# EasyEDA schematic SCH_MX80_I_MOTHERBOARD.json
TITLE: Sheet_1; REV: 1.0; Date: 2024-11-14; Sheet: 1/1; Company: MaxRetroElec
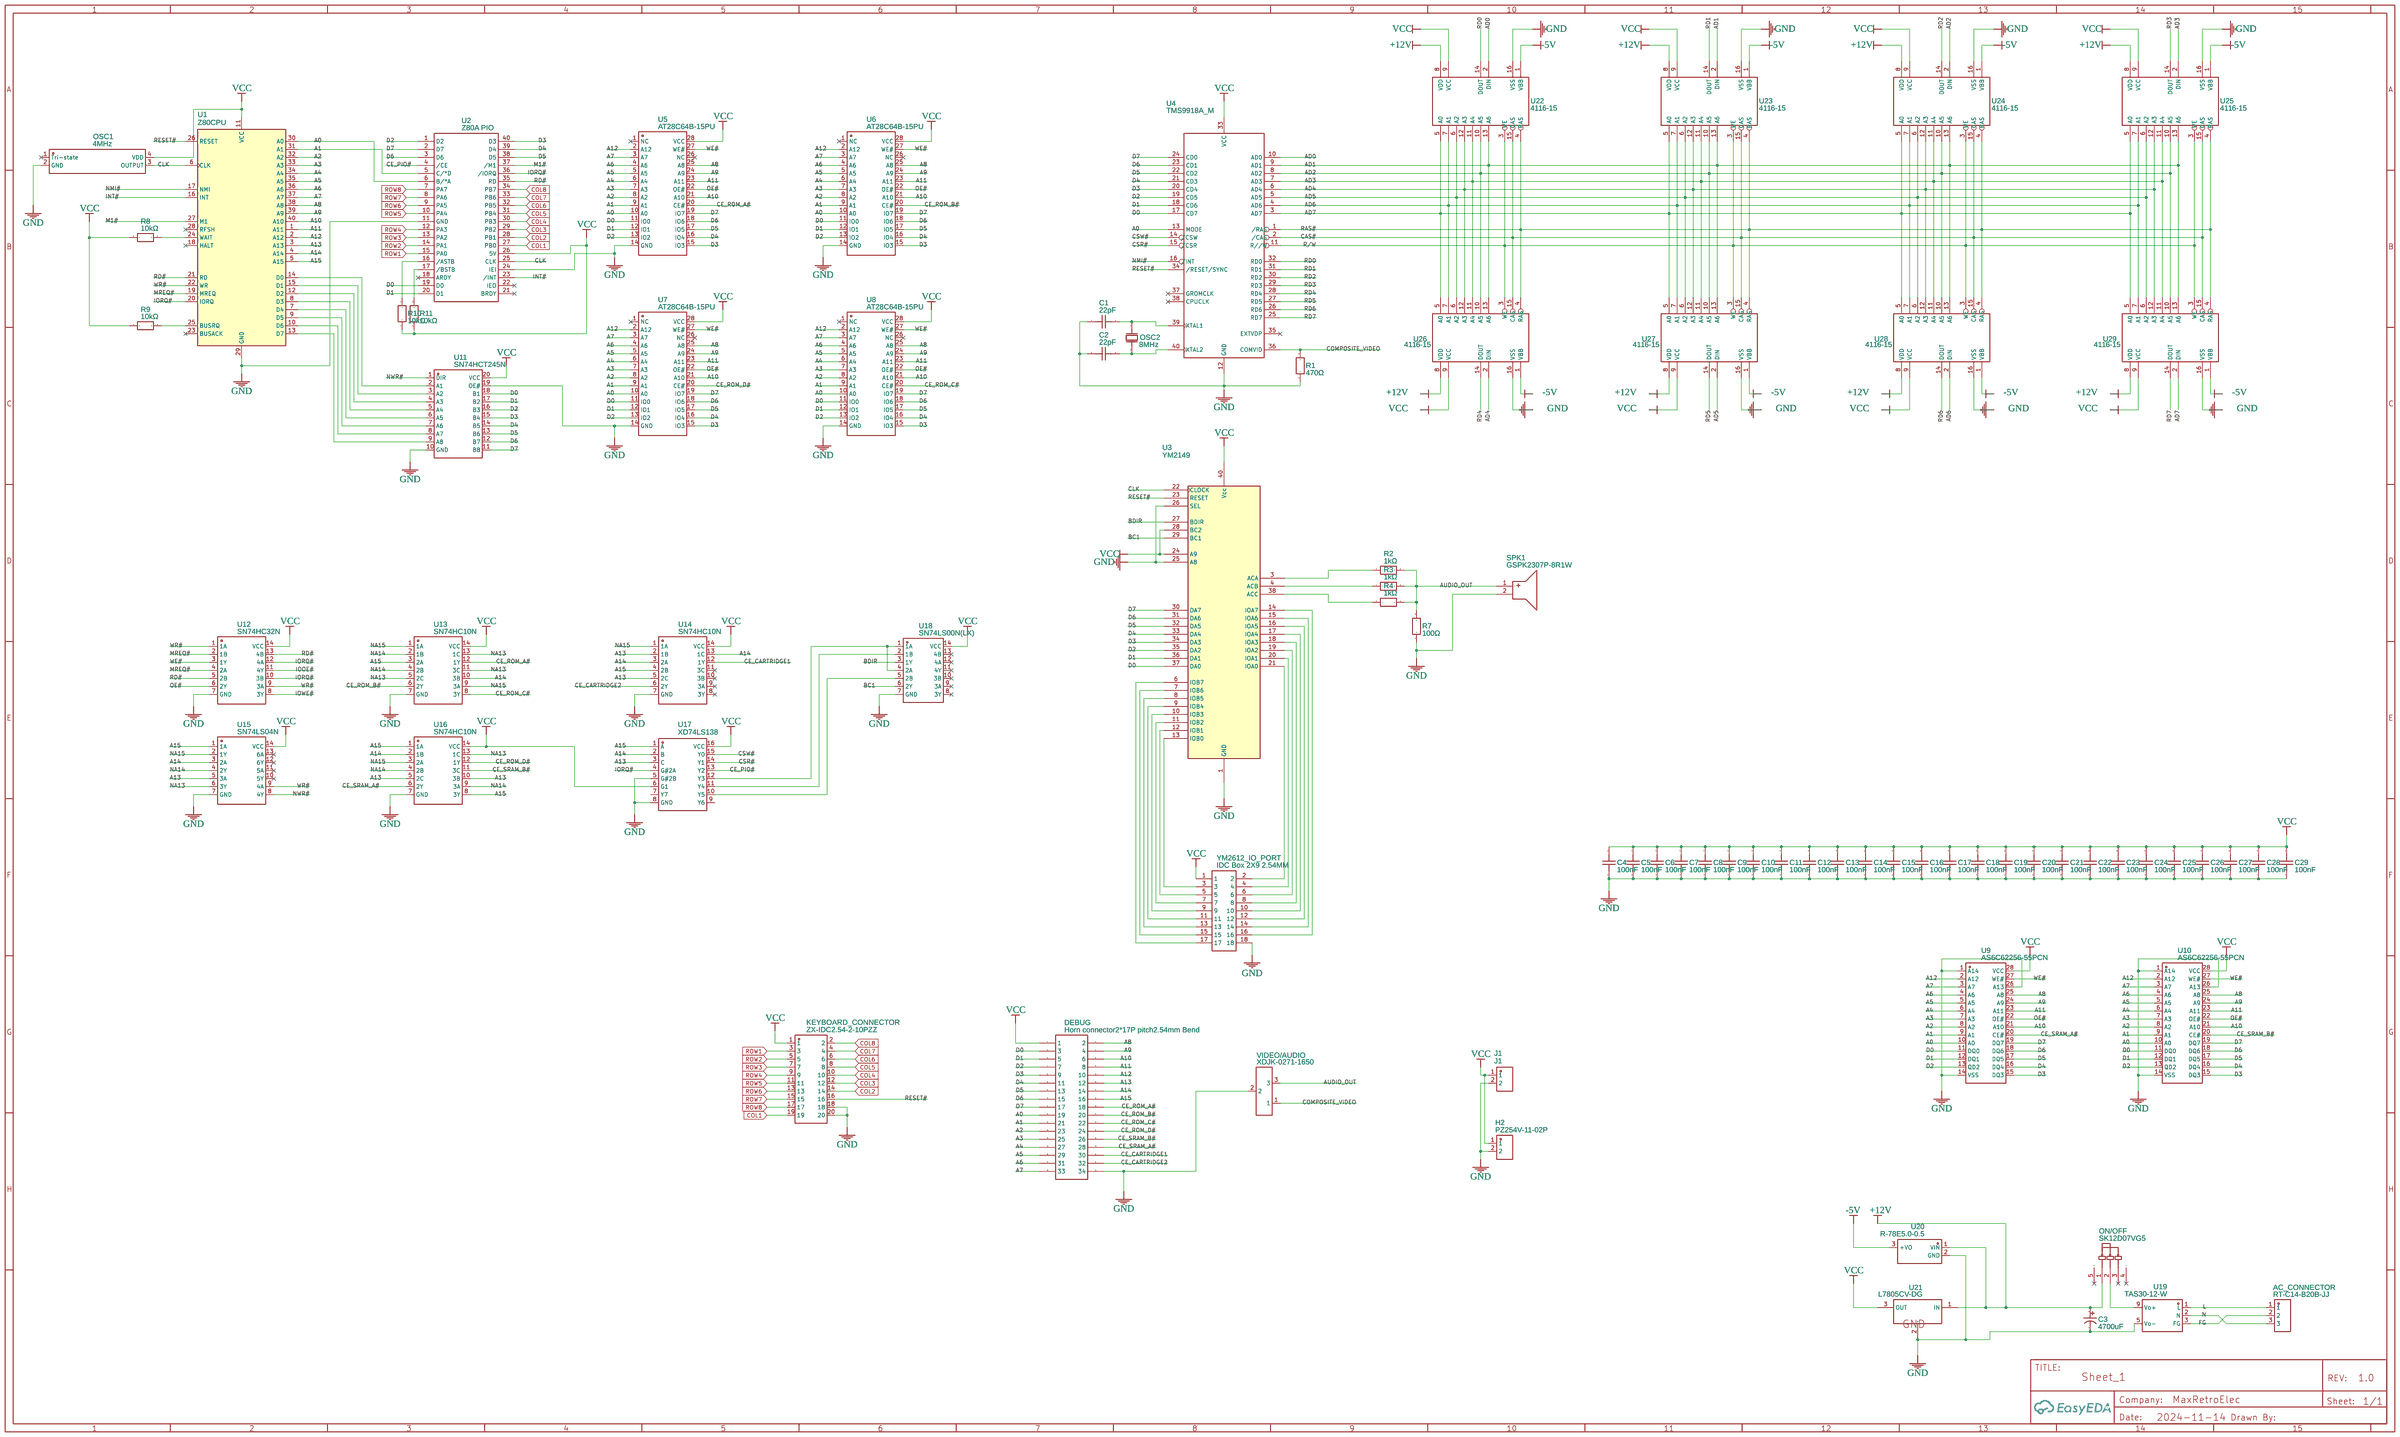
[diagram p0: schematic sheet]

## Parts
AC_CONNECTOR  RT-C14-B20B-JJ  [AC-IN-TH_LEGION_RT-C14-B20B-JJ]
C1  22pF  [CAP-TH_L7.5-W5.0-P7.50-D0.7]
C2  22pF  [CAP-TH_L7.5-W5.0-P7.50-D0.7]
C3  4700uF  [CAP-TH_BD16.0-P7.50-D1.2-FD]
C4  100nF  [CAP-TH_L5.0-W2.5-P5.08-D0.7]
C5  100nF  [CAP-TH_L5.0-W2.5-P5.08-D0.7]
C6  100nF  [CAP-TH_L5.0-W2.5-P5.08-D0.7]
C7  100nF  [CAP-TH_L5.0-W2.5-P5.08-D0.7]
C8  100nF  [CAP-TH_L5.0-W2.5-P5.08-D0.7]
C9  100nF  [CAP-TH_L5.0-W2.5-P5.08-D0.7]
C10  100nF  [CAP-TH_L5.0-W2.5-P5.08-D0.7]
C11  100nF  [CAP-TH_L5.0-W2.5-P5.08-D0.7]
C12  100nF  [CAP-TH_L5.0-W2.5-P5.08-D0.7]
C13  100nF  [CAP-TH_L5.0-W2.5-P5.08-D0.7]
C14  100nF  [CAP-TH_L5.0-W2.5-P5.08-D0.7]
C15  100nF  [CAP-TH_L5.0-W2.5-P5.08-D0.7]
C16  100nF  [CAP-TH_L5.0-W2.5-P5.08-D0.7]
C17  100nF  [CAP-TH_L5.0-W2.5-P5.08-D0.7]
C18  100nF  [CAP-TH_L5.0-W2.5-P5.08-D0.7]
C19  100nF  [CAP-TH_L5.0-W2.5-P5.08-D0.7]
C20  100nF  [CAP-TH_L5.0-W2.5-P5.08-D0.7]
C21  100nF  [CAP-TH_L5.0-W2.5-P5.08-D0.7]
C22  100nF  [CAP-TH_L5.0-W2.5-P5.08-D0.7]
C23  100nF  [CAP-TH_L5.0-W2.5-P5.08-D0.7]
C24  100nF  [CAP-TH_L5.0-W2.5-P5.08-D0.7]
C25  100nF  [CAP-TH_L5.0-W2.5-P5.08-D0.7]
C26  100nF  [CAP-TH_L5.0-W2.5-P5.08-D0.7]
C27  100nF  [CAP-TH_L5.0-W2.5-P5.08-D0.7]
C28  100nF  [CAP-TH_L5.0-W2.5-P5.08-D0.7]
C29  100nF  [CAP-TH_L5.0-W2.5-P5.08-D0.7]
DEBUG  Horn connector2*17P pitch2.54mm Bend  [IDC-TH_HORNCONNECTOR2-17PPITCH2.54MMBEND]
H2  PZ254V-11-02P  [HDR-TH_2P-P2.54-V-M]
J1  J1  [HDR-TH_2P-P2.54-V-F]
KEYBOARD_CONNECTOR  ZX-IDC2.54-2-10PZZ  [IDC-TH_20P-P2.54_ZX-IDC2.54-2-10PZZ]
ON/OFF  SK12D07VG5  [SW-TH_SK12D07VG5]
OSC1  4MHz  [OSC-SMD_4P-L7.0-W5.0-BL]
OSC2  8MHz  [OSC-TH_L10.0-W4.5-P5.00]
R1  470Ω  [RES-TH_BD2.3-L6.5-P10.50-D0.5]
R2  1kΩ  [RES-TH_BD2.7-L6.2-P10.20-D0.4]
R3  1kΩ  [RES-TH_BD2.7-L6.2-P10.20-D0.4]
R4  1kΩ  [RES-TH_BD2.7-L6.2-P10.20-D0.4]
R7  100Ω  [RES-TH_BD2.7-L6.2-P10.20-D0.4]
R8  10kΩ  [RES-TH_BD2.7-L6.2-P10.20-D0.4]
R9  10kΩ  [RES-TH_BD2.7-L6.2-P10.20-D0.4]
R10  10kΩ  [RES-TH_BD2.7-L6.2-P10.20-D0.4]
R11  10kΩ  [RES-TH_BD2.7-L6.2-P10.20-D0.4]
SPK1  GSPK2307P-8R1W  [SPK-TH_BD23.0-P10.00-D0.8-L-RD]
U1  Z80CPU  [Z80DIP]
U2  Z80A PIO  [Z80A PIO]
U3  YM2149  [DIP-40_W15.24MM_LONGPADS]
U4  TMS9918A_M  [PDIP-40_L52.3-W13.8-P2.54-LS15.24-BL]
U5  AT28C64B-15PU  [DIP-28_L37.0-W13.8-P2.54-LS15.8-BL]
U6  AT28C64B-15PU  [DIP-28_L37.0-W13.8-P2.54-LS15.8-BL]
U7  AT28C64B-15PU  [DIP-28_L37.0-W13.8-P2.54-LS15.8-BL]
U8  AT28C64B-15PU  [DIP-28_L37.0-W13.8-P2.54-LS15.8-BL]
U9  AS6C62256-55PCN  [PDIP-28_L37.0-W13.5-P2.54-LS15.6-BL]
U10  AS6C62256-55PCN  [PDIP-28_L37.0-W13.5-P2.54-LS15.6-BL]
U11  SN74HCT245N  [DIP-20_L26.8-W6.4-P2.54-LS7.6-BL]
U12  SN74HC32N  [DIP-14_L19.0-W7.0-P2.54-LS7.6-BL]
U13  SN74HC10N  [DIP-14_L19.0-W7.0-P2.54-LS7.6-BL]
U14  SN74HC10N  [DIP-14_L19.0-W7.0-P2.54-LS7.6-BL]
U15  SN74LS04N  [PDIP-14_L19.7-W6.6-P2.54-LS8.3-BL]
U16  SN74HC10N  [DIP-14_L19.0-W7.0-P2.54-LS7.6-BL]
U17  XD74LS138  [DIP-16_L19.8-W6.5-P2.54-LS7.6-BL]
U18  SN74LS00N(LX)  [PDIP-14_L19.3-W6.4-P2.54-LS7.9-BL]
U19  TAS30-12-W  [PWRM-TH_TAS30-XX-W]
U20  R-78E5.0-0.5  [PWRM-TH_YLPTEC_R-78EXXX]
U21  L7805CV-DG  [TO-220-3_L10.0-W4.5-P2.54-L]
U22  4116-15  [DIP16]
U23  4116-15  [DIP16]
U24  4116-15  [DIP16]
U25  4116-15  [DIP16]
U26  4116-15  [DIP16]
U27  4116-15  [DIP16]
U28  4116-15  [DIP16]
U29  4116-15  [DIP16]
VIDEO/AUDIO  XDJK-0271-1650  [CONN-TH_XDJK-0271-1650]
YM2612_IO_PORT  IDC Box 2X9 2.54MM  [IDC-TH_18P-P2.54_300R-18P]

## Library data of the parts
AC_CONNECTOR = RT-C14-B20B-JJ: Supplier: LCSC; Supplier Part: C19190834; Manufacturer: Legion(六钧); Contributor: lcsc; JLCPCB Part Class: Extended Part
C1 C2 = CC45SL3JD220JYNNA: Contributor: LCSC; Supplier: LCSC; Supplier Part: C342437; Manufacturer: TDK; JLCPCB Part Class: Extended Part
C3 = 4700uF25V: Supplier: LCSC; Manufacturer: CX(承兴); Manufacturer Part: KM478M025K30RR0VH2FP0; Supplier Part: C30585; JLCPCB Part Class: Extended Part
C4-C29 = CC1H104ZC74D3F5O30MN: Contributor: LCSC; Supplier: LCSC; Supplier Part: C254094; Manufacturer: Dersonic(德尔创); JLCPCB Part Class: Extended Part
DEBUG = Horn connector2*17P pitch2.54mm Bend: Contributor: LCSC; Supplier: LCSC; Manufacturer: BOOMELE(博穆精密); Manufacturer Part: 2.54-2*17P弯简牛; Supplier Part: C79866; JLCPCB Part Class: Extended Part
H2 = PZ254V-11-02P: Contributor: LCSC; Supplier: LCSC; Supplier Part: C492401; Manufacturer: XFCN(兴飞); JLCPCB Part Class: Extended Part
J1 = ZX-PM2.54-1-2PY: Supplier: LCSC; Supplier Part: C7499322; Manufacturer: Megastar(兆星); Contributor: lcsc; JLCPCB Part Class: Extended Part
KEYBOARD_CONNECTOR = ZX-IDC2.54-2-10PZZ: Supplier: LCSC; Supplier Part: C7501245; Manufacturer: Megastar(兆星); Contributor: lcsc; JLCPCB Part Class: Extended Part
ON/OFF = SK12D07VG5: Contributor: LCSC; Supplier: LCSC; Supplier Part: C431548; Manufacturer: SHOU HAN(首韩); JLCPCB Part Class: Extended Part
OSC1 = S7D4.000000B20F30T: Contributor: LCSC; Supplier: LCSC; Supplier Part: C386918; Manufacturer: SCTF(星通时频); JLCPCB Part Class: Extended Part
OSC2 = X49SD8MSD2SC: Supplier: LCSC; Manufacturer: YXC(扬兴晶振); Supplier Part: C21263; JLCPCB Part Class: Extended Part
R1 = CF1/4W-470Ω±5%T52: Contributor: lcsc; Supplier: LCSC; Supplier Part: C714293; Manufacturer: 华星机电; JLCPCB Part Class: Extended Part
R2-R4 = CR1/4W-1K±5%-ST52: Contributor: lcsc; Supplier: LCSC; Supplier Part: C2894660; Manufacturer: VO(翔胜); JLCPCB Part Class: Extended Part
R7 = CR1/4W-100Ω±5%-ST52: Contributor: lcsc; Supplier: LCSC; Supplier Part: C2894648; Manufacturer: VO(翔胜); JLCPCB Part Class: Extended Part; link: https://lcsc.com/eda_search?q=C2894648&%26type=1&ref=editor
R8-R11 = CR1/4W-10K±5%-ST52: Contributor: lcsc; Supplier: LCSC; Supplier Part: C2894649; Manufacturer: VO(翔胜); JLCPCB Part Class: Extended Part; link: https://lcsc.com/eda_search?q=C2894649&%26type=1&ref=editor
SPK1 = GSPK2307P-8R1W: Contributor: LCSC; Supplier: LCSC; Supplier Part: C530531; Manufacturer: INGHAi(赢海); JLCPCB Part Class: Extended Part
U1 = Z80CPU: Contributor: capsule5000
U2 = Z80A PIO: Supplier: Zilog; Contributor: latsirk399
U3 = YM2149: Contributor: David Sporn
U4 = TMS9918A_M: Contributor: Peti
U5-U8 = AT28C64B-15PU: Supplier: LCSC; Manufacturer: MICROCHIP(美国微芯); Supplier Part: C41982; JLCPCB Part Class: Extended Part
U9 U10 = AS6C62256-55PCN: Supplier: LCSC; Supplier Part: C5569983; Manufacturer: Alliance Memory; JLCPCB Part Class: Extended Part; Contributor: lcsc
U11 = SN74HCT245N: Contributor: LCSC; Supplier: LCSC; Supplier Part: C133640; Manufacturer: TI(德州仪器); JLCPCB Part Class: Extended Part
U12 = SN74HC32N: Supplier: LCSC; Manufacturer: TI(德州仪器); Supplier Part: C2894; JLCPCB Part Class: Extended Part
U13 U14 U16 = SN74HC10N: Supplier: LCSC; Manufacturer: TI(德州仪器); Supplier Part: C2888; JLCPCB Part Class: Extended Part
U15 = SN74LS04N: Contributor: LCSC; Supplier: LCSC; Supplier Part: C183657; Manufacturer: TI(德州仪器); JLCPCB Part Class: Extended Part
U17 = XD74LS138: Contributor: LCSC; Supplier: LCSC; Supplier Part: C513527; Manufacturer: XINLUDA(信路达); JLCPCB Part Class: Extended Part
U18 = SN74LS00N(LX): Supplier: LCSC; Supplier Part: C22374089; Manufacturer: LX(灵星芯微); JLCPCB Part Class: Extended Part; Contributor: lcsc
U19 = TAS30-12-W: Contributor: LCSC; Supplier: LCSC; Supplier Part: C570985; Manufacturer: TDPOWER(腾达电源); JLCPCB Part Class: Extended Part
U20 = R-78E5.0-0.5: Supplier: LCSC; Supplier Part: C18212367; Manufacturer: YLPTEC(易川); Contributor: lcsc; JLCPCB Part Class: Extended Part; link: https://lcsc.com/eda_search?q=C18212367&%26type=1&ref=editor
U21 = L7805CV-DG: Supplier: LCSC; Manufacturer: ST(意法半导体); Supplier Part: C3795; JLCPCB Part Class: Extended Part
U22-U29 = 4116-15: Manufacturer: Major Brands; Supplier: Jameco; Supplier Part: 41339; link: https://www.jameco.com/Jameco/Products/ProdDS/41339%20Fujitsu.pdf; Contributor: valdezramses03
VIDEO/AUDIO = XDJK-0271-1650: Supplier: LCSC; Supplier Part: C7527522; Manufacturer: LX(连欣科技); Contributor: lcsc; JLCPCB Part Class: Extended Part
YM2612_IO_PORT = IDC Box 2X9 2.54MM: Contributor: LCSC; Supplier: LCSC; Manufacturer: BOOMELE(博穆精密); Manufacturer Part: 2.54-2*9P 弯 简牛; Supplier Part: C9143; JLCPCB Part Class: Extended Part

## Nets
+12V: C3.1 ON/OFF.1 U20.1(VIN) U21.1(IN) U22.8(VDD) U23.8(VDD) U24.8(VDD) U25.8(VDD) U26.8(VDD) U27.8(VDD) U28.8(VDD) U29.8(VDD)
-5V: U20.3(+VO) U22.1(VBB) U23.1(VBB) U24.1(VBB) U25.1(VBB) U26.1(VBB) U27.1(VBB) U28.1(VBB) U29.1(VBB)
GND: C1.1 C2.1 C3.2 C4.1 C5.1 C6.1 C7.1 C8.1 C9.1 C10.1 C11.1 C12.1 C13.1 C14.1 C15.1 C16.1 C17.1 C18.1 C19.1 C20.1 C21.1 C22.1 C23.1 C24.1 C25.1 C26.1 C27.1 C28.1 C29.1 DEBUG.34 H2.2 J1.2 KEYBOARD_CONNECTOR.18 KEYBOARD_CONNECTOR.20 OSC1.2(GND) R1.1 R7.1 SPK1.2(-) U1.29(GND) U2.11(GND) U2.24(IEI) U3.1(GND) U3.25(A8) U3.26(SEL) U4.12(GND) U5.14(GND) U6.14(GND) U7.14(GND) U8.14(GND) U9.1(A14) U9.14(VSS) U9.26(A13) U10.1(A14) U10.14(VSS) U10.26(A13) U11.10(GND) U11.19(OE#) U12.7(GND) U13.7(GND) U14.7(GND) U15.7(GND) U16.7(GND) U17.5(G#2B) U17.8(GND) U18.7(GND) U19.5(Vo-) U20.2(GND) U21.2(GND) U22.16(VSS) U23.16(VSS) U24.16(VSS) U25.16(VSS) U26.16(VSS) U27.16(VSS) U28.16(VSS) U29.16(VSS) VIDEO/AUDIO.2 YM2612_IO_PORT.18
VCC: C4.2 C5.2 C6.2 C7.2 C8.2 C9.2 C10.2 C11.2 C12.2 C13.2 C14.2 C15.2 C16.2 C17.2 C18.2 C19.2 C20.2 C21.2 C22.2 C23.2 C24.2 C25.2 C26.2 C27.2 C28.2 C29.2 DEBUG.1 H2.1 J1.1 KEYBOARD_CONNECTOR.1 OSC1.4(VDD) R8.1 R9.1 R10.1 R11.1 U1.11(VCC) U2.26(5V) U3.24(A9) U3.28(BC2) U3.40(Vcc) U4.33(VCC) U5.28(VCC) U6.28(VCC) U7.28(VCC) U8.28(VCC) U9.28(VCC) U10.28(VCC) U11.20(VCC) U12.14(VCC) U13.14(VCC) U14.14(VCC) U15.14(VCC) U16.14(VCC) U17.6(G1) U17.16(VCC) U18.14(VCC) U21.3(OUT) U22.9(VCC) U23.9(VCC) U24.9(VCC) U25.9(VCC) U26.9(VCC) U27.9(VCC) U28.9(VCC) U29.9(VCC) YM2612_IO_PORT.1
A0: DEBUG.19 U1.30(A0) U2.6(B/*A) U4.13(MODE) U5.10(A0) U6.10(A0) U7.10(A0) U8.10(A0) U9.10(A0) U10.10(A0)
A1: DEBUG.21 U1.31(A1) U2.5(C/*D) U5.9(A1) U6.9(A1) U7.9(A1) U8.9(A1) U9.9(A1) U10.9(A1)
A2: DEBUG.23 U1.32(A2) U5.8(A2) U6.8(A2) U7.8(A2) U8.8(A2) U9.8(A2) U10.8(A2)
A3: DEBUG.25 U1.33(A3) U5.7(A3) U6.7(A3) U7.7(A3) U8.7(A3) U9.7(A3) U10.7(A3)
A4: DEBUG.27 U1.34(A4) U5.6(A4) U6.6(A4) U7.6(A4) U8.6(A4) U9.6(A4) U10.6(A4)
A5: DEBUG.29 U1.35(A5) U5.5(A5) U6.5(A5) U7.5(A5) U8.5(A5) U9.5(A5) U10.5(A5)
A6: DEBUG.31 U1.36(A6) U5.4(A6) U6.4(A6) U7.4(A6) U8.4(A6) U9.4(A6) U10.4(A6)
A7: DEBUG.33 U1.37(A7) U5.3(A7) U6.3(A7) U7.3(A7) U8.3(A7) U9.3(A7) U10.3(A7)
A8: DEBUG.2 U1.38(A8) U5.25(A8) U6.25(A8) U7.25(A8) U8.25(A8) U9.25(A8) U10.25(A8)
A9: DEBUG.4 U1.39(A9) U5.24(A9) U6.24(A9) U7.24(A9) U8.24(A9) U9.24(A9) U10.24(A9)
A10: DEBUG.6 U1.40(A10) U5.21(A10) U6.21(A10) U7.21(A10) U8.21(A10) U9.21(A10) U10.21(A10)
A11: DEBUG.8 U1.1(A11) U5.23(A11) U6.23(A11) U7.23(A11) U8.23(A11) U9.23(A11) U10.23(A11)
A12: DEBUG.10 U1.2(A12) U5.2(A12) U6.2(A12) U7.2(A12) U8.2(A12) U9.2(A12) U10.2(A12)
A13: DEBUG.12 U1.3(A13) U14.2(1B) U14.5(2C) U15.5(3A) U16.5(2C) U16.10(3B) U17.3(C)
A14: DEBUG.14 U1.4(A14) U13.10(3B) U14.3(2A) U14.13(1C) U15.3(2A) U16.2(1B) U17.2(B)
A15: DEBUG.16 U1.5(A15) U13.3(2A) U14.4(2B) U15.1(1A) U16.1(1A) U16.8(3Y) U17.1(A)
AD0: U4.10(AD0) U22.2(DIN)
AD1: U4.9(AD1) U22.13(A6) U23.2(DIN) U23.13(A6) U24.13(A6) U25.13(A6) U26.13(A6) U27.13(A6) U28.13(A6) U29.13(A6)
AD2: U4.8(AD2) U22.10(A5) U23.10(A5) U24.2(DIN) U24.10(A5) U25.10(A5) U26.10(A5) U27.10(A5) U28.10(A5) U29.10(A5)
AD3: U4.7(AD3) U22.11(A4) U23.11(A4) U24.11(A4) U25.2(DIN) U25.11(A4) U26.11(A4) U27.11(A4) U28.11(A4) U29.11(A4)
AD4: U4.6(AD4) U22.12(A3) U23.12(A3) U24.12(A3) U25.12(A3) U26.2(DIN) U26.12(A3) U27.12(A3) U28.12(A3) U29.12(A3)
AD5: U4.5(AD5) U22.6(A2) U23.6(A2) U24.6(A2) U25.6(A2) U26.6(A2) U27.2(DIN) U27.6(A2) U28.6(A2) U29.6(A2)
AD6: U4.4(AD6) U22.7(A1) U23.7(A1) U24.7(A1) U25.7(A1) U26.7(A1) U27.7(A1) U28.2(DIN) U28.7(A1) U29.7(A1)
AD7: U4.3(AD7) U22.5(A0) U23.5(A0) U24.5(A0) U25.5(A0) U26.5(A0) U27.5(A0) U28.5(A0) U29.2(DIN) U29.5(A0)
AUDIO_OUT: R2.2 R3.2 R4.2 R7.2 SPK1.1(+) VIDEO/AUDIO.3
BC1: U3.29(BC1) U18.6(2Y)
BDIR: U3.27(BDIR) U18.3(1Y)
CAS#: U4.2(/CAS) U22.15(CAS) U23.15(CAS) U24.15(CAS) U25.15(CAS) U26.15(CAS) U27.15(CAS) U28.15(CAS) U29.15(CAS)
CE_CARTRIDGE1: DEBUG.30 U14.12(1Y)
CE_CARTRIDGE2: DEBUG.32 U14.6(2Y)
CE_PIO#: U2.4(/CE) U17.13(Y2)
CE_ROM_A#: DEBUG.18 U5.20(CE#) U13.12(1Y)
CE_ROM_B#: DEBUG.20 U6.20(CE#) U13.6(2Y)
CE_ROM_C#: DEBUG.22 U8.20(CE#) U13.8(3Y)
CE_ROM_D#: DEBUG.24 U7.20(CE#) U16.12(1Y)
CE_SRAM_A#: DEBUG.28 U9.20(CE#) U16.6(2Y)
CE_SRAM_B#: DEBUG.26 U10.20(CE#) U16.11(3C)
CLK: OSC1.3(OUTPUT) U1.6(CLK) U2.25(CLK) U3.22(CLOCK)
COL1: KEYBOARD_CONNECTOR.19 U2.27(PB0)
COL2: KEYBOARD_CONNECTOR.14 U2.28(PB1)
COL3: KEYBOARD_CONNECTOR.12 U2.29(PB2)
COL4: KEYBOARD_CONNECTOR.10 U2.30(PB3)
COL5: KEYBOARD_CONNECTOR.8 U2.31(PB4)
COL6: KEYBOARD_CONNECTOR.6 U2.32(PB5)
COL7: KEYBOARD_CONNECTOR.4 U2.33(PB6)
COL8: KEYBOARD_CONNECTOR.2 U2.34(PB7)
COMPOSITE_VIDEO: R1.2 U4.36(COMVID) VIDEO/AUDIO.1
CSR#: U4.15(/CSR) U17.14(Y1)
CSW#: U4.14(/CSW) U17.15(Y0)
D0: DEBUG.3 U2.19(D0) U3.37(DA0) U4.17(CD7) U5.11(IO0) U6.11(IO0) U7.11(IO0) U8.11(IO0) U9.11(DQ0) U10.11(DQ0) U11.18(B1)
D1: DEBUG.5 U2.20(D1) U3.36(DA1) U4.18(CD6) U5.12(IO1) U6.12(IO1) U7.12(IO1) U8.12(IO1) U9.12(DQ1) U10.12(DQ1) U11.17(B2)
D2: DEBUG.7 U2.1(D2) U3.35(DA2) U4.19(CD5) U5.13(IO2) U6.13(IO2) U7.13(IO2) U8.13(IO2) U9.13(QD2) U10.13(QD2) U11.16(B3)
D3: DEBUG.9 U2.40(D3) U3.34(DA3) U4.20(CD4) U5.15(IO3) U6.15(IO3) U7.15(IO3) U8.15(IO3) U9.15(DQ3) U10.15(DQ3) U11.15(B4)
D4: DEBUG.11 U2.39(D4) U3.33(DA4) U4.21(CD3) U5.16(IO4) U6.16(IO4) U7.16(IO4) U8.16(IO4) U9.16(DQ4) U10.16(DQ4) U11.14(B5)
D5: DEBUG.13 U2.38(D5) U3.32(DA5) U4.22(CD2) U5.17(IO5) U6.17(IO5) U7.17(IO5) U8.17(IO5) U9.17(DQ5) U10.17(DQ5) U11.13(B6)
D6: DEBUG.15 U2.3(D6) U3.31(DA6) U4.23(CD1) U5.18(IO6) U6.18(IO6) U7.18(IO6) U8.18(IO6) U9.18(DQ6) U10.18(DQ6) U11.12(B7)
D7: DEBUG.17 U2.2(D7) U3.30(DA7) U4.24(CD0) U5.19(IO7) U6.19(IO7) U7.19(IO7) U8.19(IO7) U9.19(DQ7) U10.19(DQ7) U11.11(B8)
FG: AC_CONNECTOR.2 U19.3(FG)
INT#: U1.16(INT) U2.23(/INT)
IOOE#: U12.11(4Y)
IORQ#: U1.20(IORQ) U2.36(/IORQ) U12.10(3B) U12.12(4A) U17.4(G#2A)
IOWE#: U12.8(3Y)
L: AC_CONNECTOR.1 U19.1(L)
M1#: U1.27(M1) U2.37(/M1)
MREQ#: U1.19(MREQ) U12.2(1B) U12.4(2A)
N: AC_CONNECTOR.3 U19.2(N)
NA13: U13.5(2C) U13.11(3C) U13.13(1C) U15.6(3Y) U16.13(1C)
NA14: U13.2(1B) U13.4(2B) U15.4(2Y) U16.4(2B) U16.9(3A)
NA15: U13.1(1A) U13.9(3A) U14.1(1A) U15.2(1Y) U16.3(2A)
NMI#: U1.17(NMI) U4.16(/INT)
NWR#: U11.1(DIR) U15.8(4Y)
OE#: U5.22(OE#) U6.22(OE#) U7.22(OE#) U8.22(OE#) U9.22(OE#) U10.22(OE#) U12.6(2Y)
R/W: U4.11(R//W) U22.3(WE) U23.3(WE) U24.3(WE) U25.3(WE) U26.3(WE) U27.3(WE) U28.3(WE) U29.3(WE)
RAS#: U4.1(/RAS) U22.4(RAS) U23.4(RAS) U24.4(RAS) U25.4(RAS) U26.4(RAS) U27.4(RAS) U28.4(RAS) U29.4(RAS)
RD0: U4.32(RD0) U22.14(DOUT)
RD1: U4.31(RD1) U23.14(DOUT)
RD2: U4.30(RD2) U24.14(DOUT)
RD3: U4.29(RD3) U25.14(DOUT)
RD4: U4.28(RD4) U26.14(DOUT)
RD5: U4.27(RD5) U27.14(DOUT)
RD6: U4.26(RD6) U28.14(DOUT)
RD7: U4.25(RD7) U29.14(DOUT)
RD#: U1.21(RD) U2.35(RD) U12.5(2B) U12.13(4B)
RESET#: KEYBOARD_CONNECTOR.16 U1.26(RESET) U3.23(RESET) U4.34(/RESET/SYNC)
ROW1: KEYBOARD_CONNECTOR.3 U2.15(PA0)
ROW2: KEYBOARD_CONNECTOR.5 U2.14(PA1)
ROW3: KEYBOARD_CONNECTOR.7 U2.13(PA2)
ROW4: KEYBOARD_CONNECTOR.9 U2.12(PA3)
ROW5: KEYBOARD_CONNECTOR.11 U2.10(PA4)
ROW6: KEYBOARD_CONNECTOR.13 U2.9(PA5)
ROW7: KEYBOARD_CONNECTOR.15 U2.8(PA6)
ROW8: KEYBOARD_CONNECTOR.17 U2.7(PA7)
WE#: U5.27(WE#) U6.27(WE#) U7.27(WE#) U8.27(WE#) U9.27(WE#) U10.27(WE#) U12.3(1Y)
WR#: U1.22(WR) U12.1(1A) U12.9(3A) U15.9(4A)
Net-(C1-2): C1.2 OSC2.1(OSC1) U4.39(XTAL1)
Net-(C2-2): C2.2 OSC2.2(OSC2) U4.40(XTAL2)
Net-(ON/OFF-2): ON/OFF.2 U19.9(Vo+)
Net-(R2-1): R2.1 U3.3(ACA)
Net-(R3-1): R3.1 U3.4(ACB)
Net-(R4-1): R4.1 U3.38(ACC)
Net-(R8-2): R8.2 U1.24(WAIT)
Net-(R9-2): R9.2 U1.25(BUSRQ)
Net-(R10-2): R10.2 U2.16(/ASTB)
Net-(R11-2): R11.2 U2.17(/BSTB)
Net-(U1-7): U1.7(D4) U11.6(A5)
Net-(U1-8): U1.8(D3) U11.5(A4)
Net-(U1-9): U1.9(D5) U11.7(A6)
Net-(U1-10): U1.10(D6) U11.8(A7)
Net-(U1-12): U1.12(D2) U11.4(A3)
Net-(U1-13): U1.13(D7) U11.9(A8)
Net-(U1-14): U1.14(D0) U11.2(A1)
Net-(U1-15): U1.15(D1) U11.3(A2)
Net-(U3-6): U3.6(IOB7) YM2612_IO_PORT.17
Net-(U3-7): U3.7(IOB6) YM2612_IO_PORT.15
Net-(U3-8): U3.8(IOB5) YM2612_IO_PORT.13
Net-(U3-9): U3.9(IOB4) YM2612_IO_PORT.11
Net-(U3-10): U3.10(IOB3) YM2612_IO_PORT.9
Net-(U3-11): U3.11(IOB2) YM2612_IO_PORT.7
Net-(U3-12): U3.12(IOB1) YM2612_IO_PORT.5
Net-(U3-13): U3.13(IOB0) YM2612_IO_PORT.3
Net-(U3-14): U3.14(IOA7) YM2612_IO_PORT.16
Net-(U3-15): U3.15(IOA6) YM2612_IO_PORT.14
Net-(U3-16): U3.16(IOA5) YM2612_IO_PORT.12
Net-(U3-17): U3.17(IOA4) YM2612_IO_PORT.10
Net-(U3-18): U3.18(IOA3) YM2612_IO_PORT.8
Net-(U3-19): U3.19(IOA2) YM2612_IO_PORT.6
Net-(U3-20): U3.20(IOA1) YM2612_IO_PORT.4
Net-(U3-21): U3.21(IOA0) YM2612_IO_PORT.2
Net-(U17-10): U17.10(Y5) U18.5(2B)
Net-(U17-11): U17.11(Y4) U18.2(1B)
Net-(U17-12): U17.12(Y3) U18.1(1A) U18.4(2A)

Not connected (* = marked no-connect by the designer): ON/OFF 3* 4* 5*; OSC1 1(Tri-state)*; U1 18(HALT)* 23(BUSACK)* 28(RFSH)*; U2 18(ARDY)* 21(BRDY)* 22(IEO)*; U4 35(EXTVDP)* 37(GROMCLK)* 38(CPUCLK)*; U5 1(NC)* 26(NC)*; U6 1(NC)* 26(NC)*; U7 1(NC)* 26(NC)*; U8 1(NC)* 26(NC)*; U14 8(3Y)* 9(3A)* 10(3B)* 11(3C)*; U15 10(5Y)* 11(5A)* 12(6Y)* 13(6A)*; U17 7(Y7) 9(Y6); U18 8(3Y)* 9(3A)* 10(3B)* 11(4Y)* 12(4A)* 13(4B)*
